# EAGLE design RPR-220_board (EAGLE 4.16)
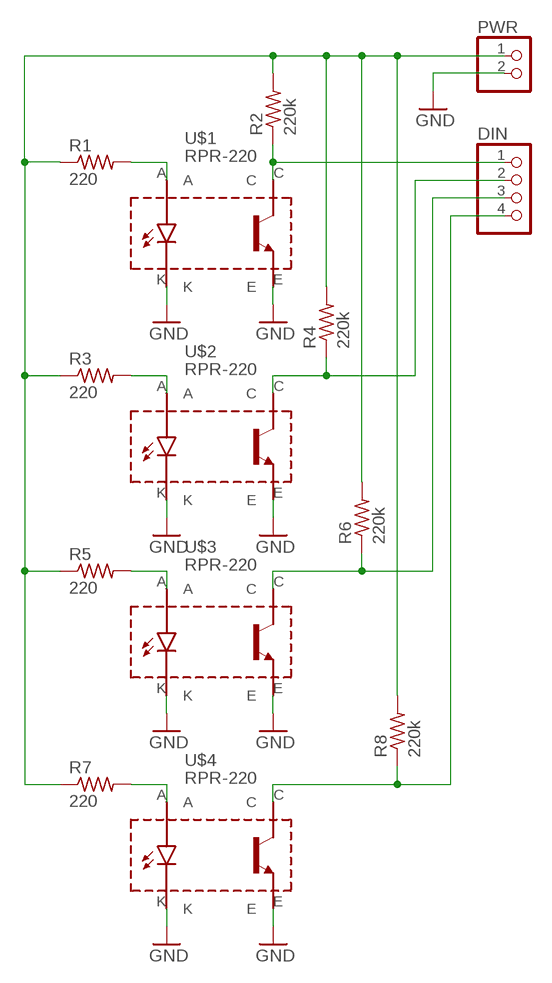
[diagram p0: schematic, sheet 1]

## Parts
DIN  PINHD-1X4  [1X04]
PWR  PINHD-1X2  [1X02]
R1  220  R-US_0204/5  [0204/5]
R2  220k  R-US_0204/5  [0204/5]
R3  220  R-US_0204/5  [0204/5]
R4  220k  R-US_0204/5  [0204/5]
R5  220  R-US_0204/5  [0204/5]
R6  220k  R-US_0204/5  [0204/5]
R7  220  R-US_0204/5  [0204/5]
R8  220k  R-US_0204/5  [0204/5]
U$1  RPR-220  [RPR-220]
U$2  RPR-220  [RPR-220]
U$3  RPR-220  [RPR-220]
U$4  RPR-220  [RPR-220]

## Nets
DIN: DIN.1 R2.1 U$1.C
GND: PWR.2 U$1.E U$1.K U$2.E U$2.K U$3.E U$3.K U$4.E U$4.K
N$1: R1.2 U$1.A
N$2: DIN.4 R8.1 U$4.C
N$3: DIN.3 R6.1 U$3.C
N$6: PWR.1 R1.1 R2.2 R3.1 R4.2 R5.1 R6.2 R7.1 R8.2
N$7: DIN.2 R4.1 U$2.C
N$8: R3.2 U$2.A
N$10: R5.2 U$3.A
N$11: R7.2 U$4.A

## Library data of the parts
DIN = pinhead:PINHD-1X4: PIN HEADER
PWR = pinhead:PINHD-1X2: PIN HEADER
R1-R8 = rcl:R-US_: RESISTOR, American symbol
U$1-U$4 = omron_rpr-220:RPR-220

## Board
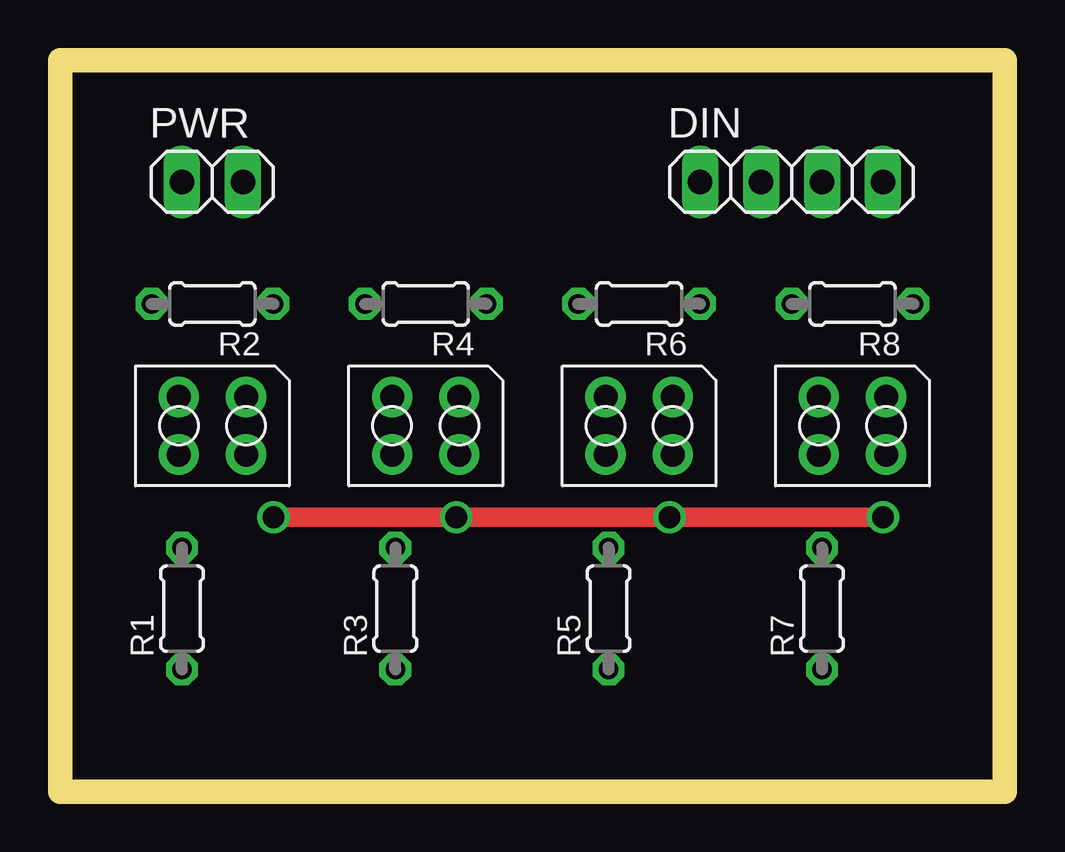
[diagram p1: board, top side]
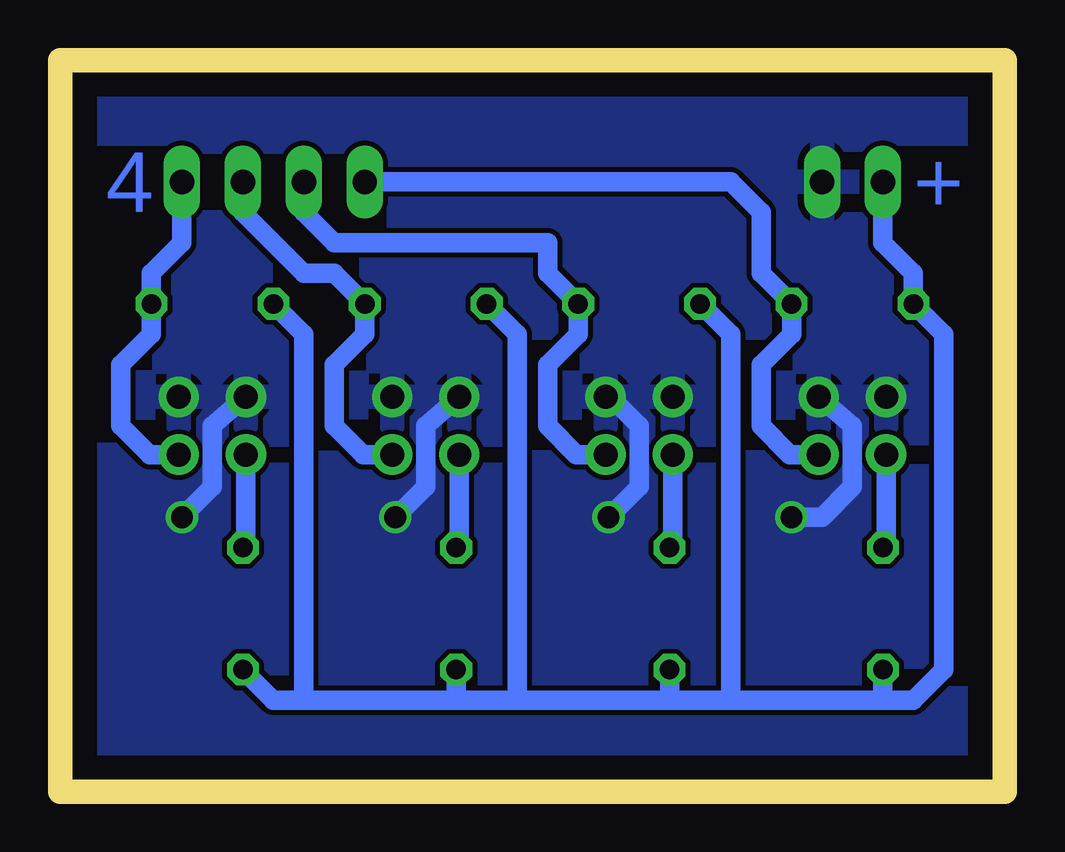
[diagram p2: board, bottom side, seen from below]

Size 39.37 x 30.48 mm. Coordinates in mm from the lower left corner, seen from the top.
Outline: 0,0 0,30.48 39.37,30.48 39.37,0 0,0
Copper layers (1*16): Top 0.035mm / dielectric 1.5mm / Bottom 0.035mm
Design rules "default": minimum track width 10mil, minimum drill 24mil, track to track 8mil, track to pad 8mil, pad to pad 8mil, via to via 8mil, smd to smd 8mil, copper to edge 40mil, drill to drill 8mil, minimum pad ring 10mil, minimum via ring 8mil, stop-mask expansion 4mil, vias tented up to drill 0mil, thermal gap 10mil

### Footprints (pad centres in the part's own frame; a part is rotated, then mirrored left to right if it is on the bottom)
1X04 = drill 1.016 long: 1 -3.81,0; 2 -1.27,0; 3 1.27,0; 4 3.81,0
1X02 = drill 1.016 long: 1 -1.27,0; 2 1.27,0
0204/5 = drill 0.813 octagon: 1 -2.54,0; 2 2.54,0
RPR-220 = drill 1 pad 1.676 round: A -1.4,-1.2; C 1.4,-1.2; E 1.4,1.2; K -1.4,1.2

### Placement (x,y rotation side)
DIN  30.48,25.4 0 top
PWR  6.35,25.4 0 top
R1  5.08,7.62 90 top
R2  6.35,20.32 180 top
R3  13.97,7.62 90 top
R4  15.24,20.32 180 top
R5  22.86,7.62 90 top
R6  24.13,20.32 180 top
R7  31.75,7.62 90 top
R8  33.02,20.32 180 top
U$1  6.35,15.24 0 top
U$2  15.24,15.24 0 top
U$3  24.13,15.24 0 top
U$4  33.02,15.24 0 top

### Tracks (layer width: path | path; a pad name or v marks a point on that pad's centre or on a via)
DIN
  Bottom 0.813: U$1.C 8.96,14.04 10.16,15.24 10.16,17.78 8.89,19.05 R2.1 10.16,21.59 10.16,24.13 11.43,25.4 DIN.1
GND  (via drill 0.9)
  Top 0.813: v8.89,11.43 v16.51,11.43 v25.4,11.43 v34.29,11.43
  Bottom 0.813: U$1.E 6.35,15.24 6.35,12.7 7.62,11.43 v8.89,11.43 | v16.51,11.43 15.24,12.7 15.24,15.24 16.51,16.51 U$2.E | U$3.K 24.13,15.24 24.13,12.7 v25.4,11.43 | U$4.K 33.02,15.24 33.02,12.7 v34.29,11.43
  pour Bottom: -1.27,31.75 40.64,31.75 40.64,-1.27 -1.27,-1.27
N$1
  Bottom 0.813: U$1.A 4.95,10.29 R1.2
N$2
  Bottom 0.813: U$4.C 35.63,14.04 36.83,15.24 36.83,17.78 35.56,19.05 R8.1 35.56,21.59 34.29,22.86 DIN.4
N$3
  Bottom 0.813: U$3.C 26.74,14.04 27.94,15.24 27.94,17.78 26.67,19.05 R6.1 27.94,21.59 29.21,21.59 31.75,24.13 DIN.3
N$6
  Bottom 0.813: PWR.1 5.08,22.86 3.81,21.59 R2.2 2.54,19.05 2.54,5.08 3.81,3.81 5.08,3.81 | R8.2 29.21,19.05 29.21,3.81 | 29.21,3.81 30.48,3.81 R7.1 | 22.86,3.81 R5.1 | 22.86,3.81 29.21,3.81 | 13.97,3.81 R3.1 | 13.97,3.81 20.32,3.81 | 20.32,3.81 22.86,3.81 | 5.08,3.81 R1.1 | 5.08,3.81 11.43,3.81 | 11.43,3.81 13.97,3.81 | R4.2 11.43,19.05 11.43,3.81 | R6.2 20.32,19.05 20.32,3.81
N$7
  Bottom 0.813: U$2.C 17.85,14.04 19.05,15.24 19.05,17.78 17.78,19.05 R4.1 19.05,21.59 19.05,22.86 27.94,22.86 29.21,24.13 DIN.2
N$8
  Bottom 0.813: U$2.A 13.84,10.29 R3.2
N$10
  Bottom 0.813: U$3.A 22.73,10.29 R5.2
N$11
  Bottom 0.813: U$4.A 31.62,10.29 R7.2

### Text on the board
Bottom: + | 4